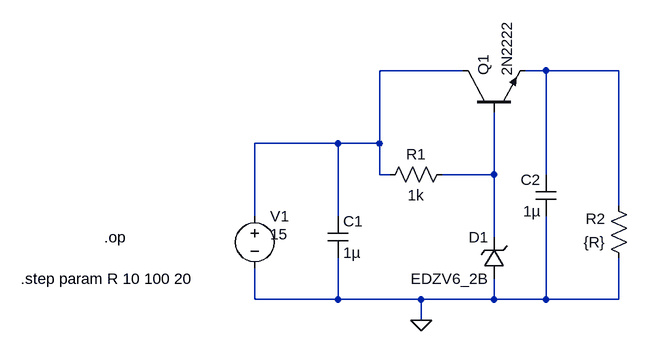
[diagram p0: schematic SeriesVoltage.asc]
SeriesVoltage.asc, the LTspice schematic file:
Version 4
SHEET 1 880 680
WIRE 384 -96 256 -96
WIRE 512 -96 480 -96
WIRE 624 -96 512 -96
WIRE 192 16 64 16
WIRE 256 16 256 -96
WIRE 256 16 192 16
WIRE 256 64 256 16
WIRE 272 64 256 64
WIRE 432 64 432 -32
WIRE 432 64 352 64
WIRE 512 64 512 -96
WIRE 624 112 624 -96
WIRE 64 128 64 16
WIRE 192 128 192 16
WIRE 432 160 432 64
WIRE 64 256 64 208
WIRE 192 256 192 192
WIRE 192 256 64 256
WIRE 320 256 192 256
WIRE 432 256 432 224
WIRE 432 256 320 256
WIRE 512 256 512 128
WIRE 512 256 432 256
WIRE 624 256 624 192
WIRE 624 256 512 256
WIRE 320 288 320 256
FLAG 320 288 0
SYMBOL voltage 64 112 R0
WINDOW 3 24 44 Left 2
WINDOW 123 0 0 Left 0
WINDOW 39 0 0 Left 0
SYMATTR InstName V1
SYMATTR Value 15
SYMBOL cap 176 128 R0
SYMATTR InstName C1
SYMATTR Value 1µ
SYMBOL cap 528 128 R180
WINDOW 0 24 56 Left 2
WINDOW 3 24 8 Left 2
SYMATTR InstName C2
SYMATTR Value 1µ
SYMBOL res 640 208 R180
WINDOW 0 36 76 Left 2
WINDOW 3 36 40 Left 2
SYMATTR InstName R2
SYMATTR Value {R}
SYMBOL npn 384 -32 R270
SYMATTR InstName Q1
SYMATTR Value 2N2222
SYMBOL res 368 48 R90
WINDOW 0 0 56 VBottom 2
WINDOW 3 32 56 VTop 2
SYMATTR InstName R1
SYMATTR Value 1k
SYMBOL zener 448 224 R180
WINDOW 0 24 64 Left 2
WINDOW 3 24 0 Left 2
SYMATTR InstName D1
SYMATTR Value EDZV6_2B
TEXT -296 224 Left 2 !.step param R 10 100 20
TEXT -168 160 Left 2 !.op

The netlist it stands for:
* SeriesVoltage.asc
V1 N001 0 15
C1 N001 0 1µ
C2 0 N002 1µ
R2 0 N002 {R}
Q1 N001 N003 N002 0 2N2222
R1 N003 N001 1k
D1 0 N003 EDZV6_2B
.model D D
.lib standard.dio
.model NPN NPN
.model PNP PNP
.lib standard.bjt
.step param R 10 100 20
.op
.backanno
.end